# EAGLE schematic BBQ (EAGLE 6.5.0)
CHECK_DATE: 05.03.14; DRAW_DATE: 11.03.14; PROJECT: TMC_breakout_board_panel_1; REV: 01B

## Sheet 1 of 3
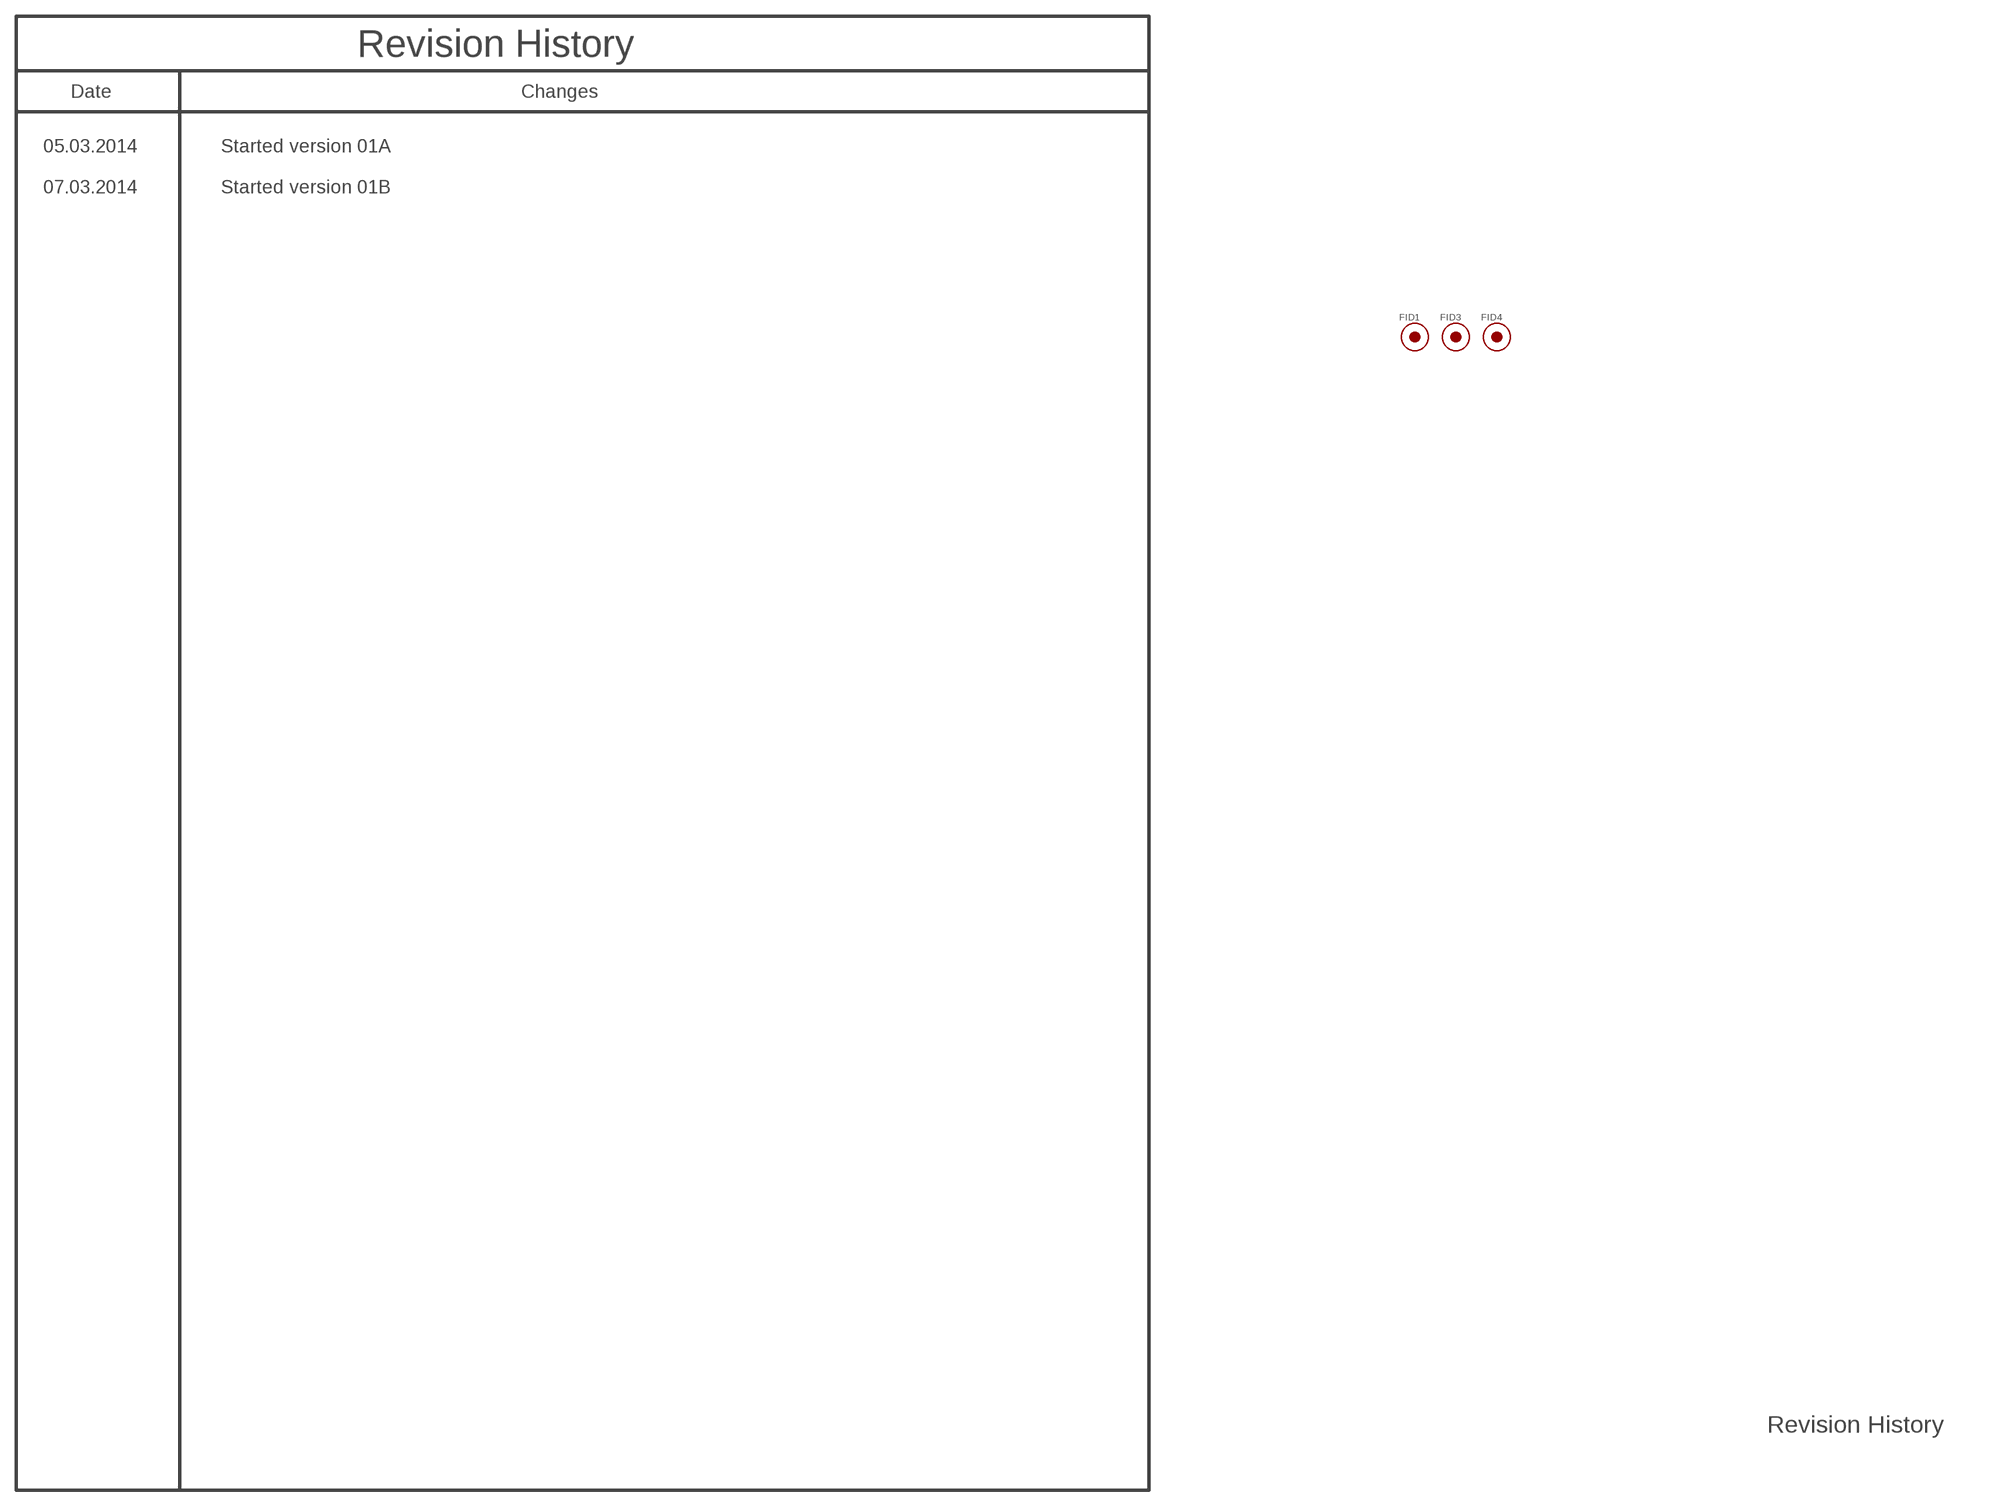
[diagram p0: schematic, sheet 1]

### Parts
FID1  FIDUCIAL  [FIDUCIAL]
FID3  FIDUCIAL  [FIDUCIAL]
FID4  FIDUCIAL  [FIDUCIAL]

### Notes on the sheet
- Revision History
- Date | Changes
- 05.03.2014 | Started version 01A
- 07.03.2014 | Started version 01B
- Revision History

## Sheet 2 of 3
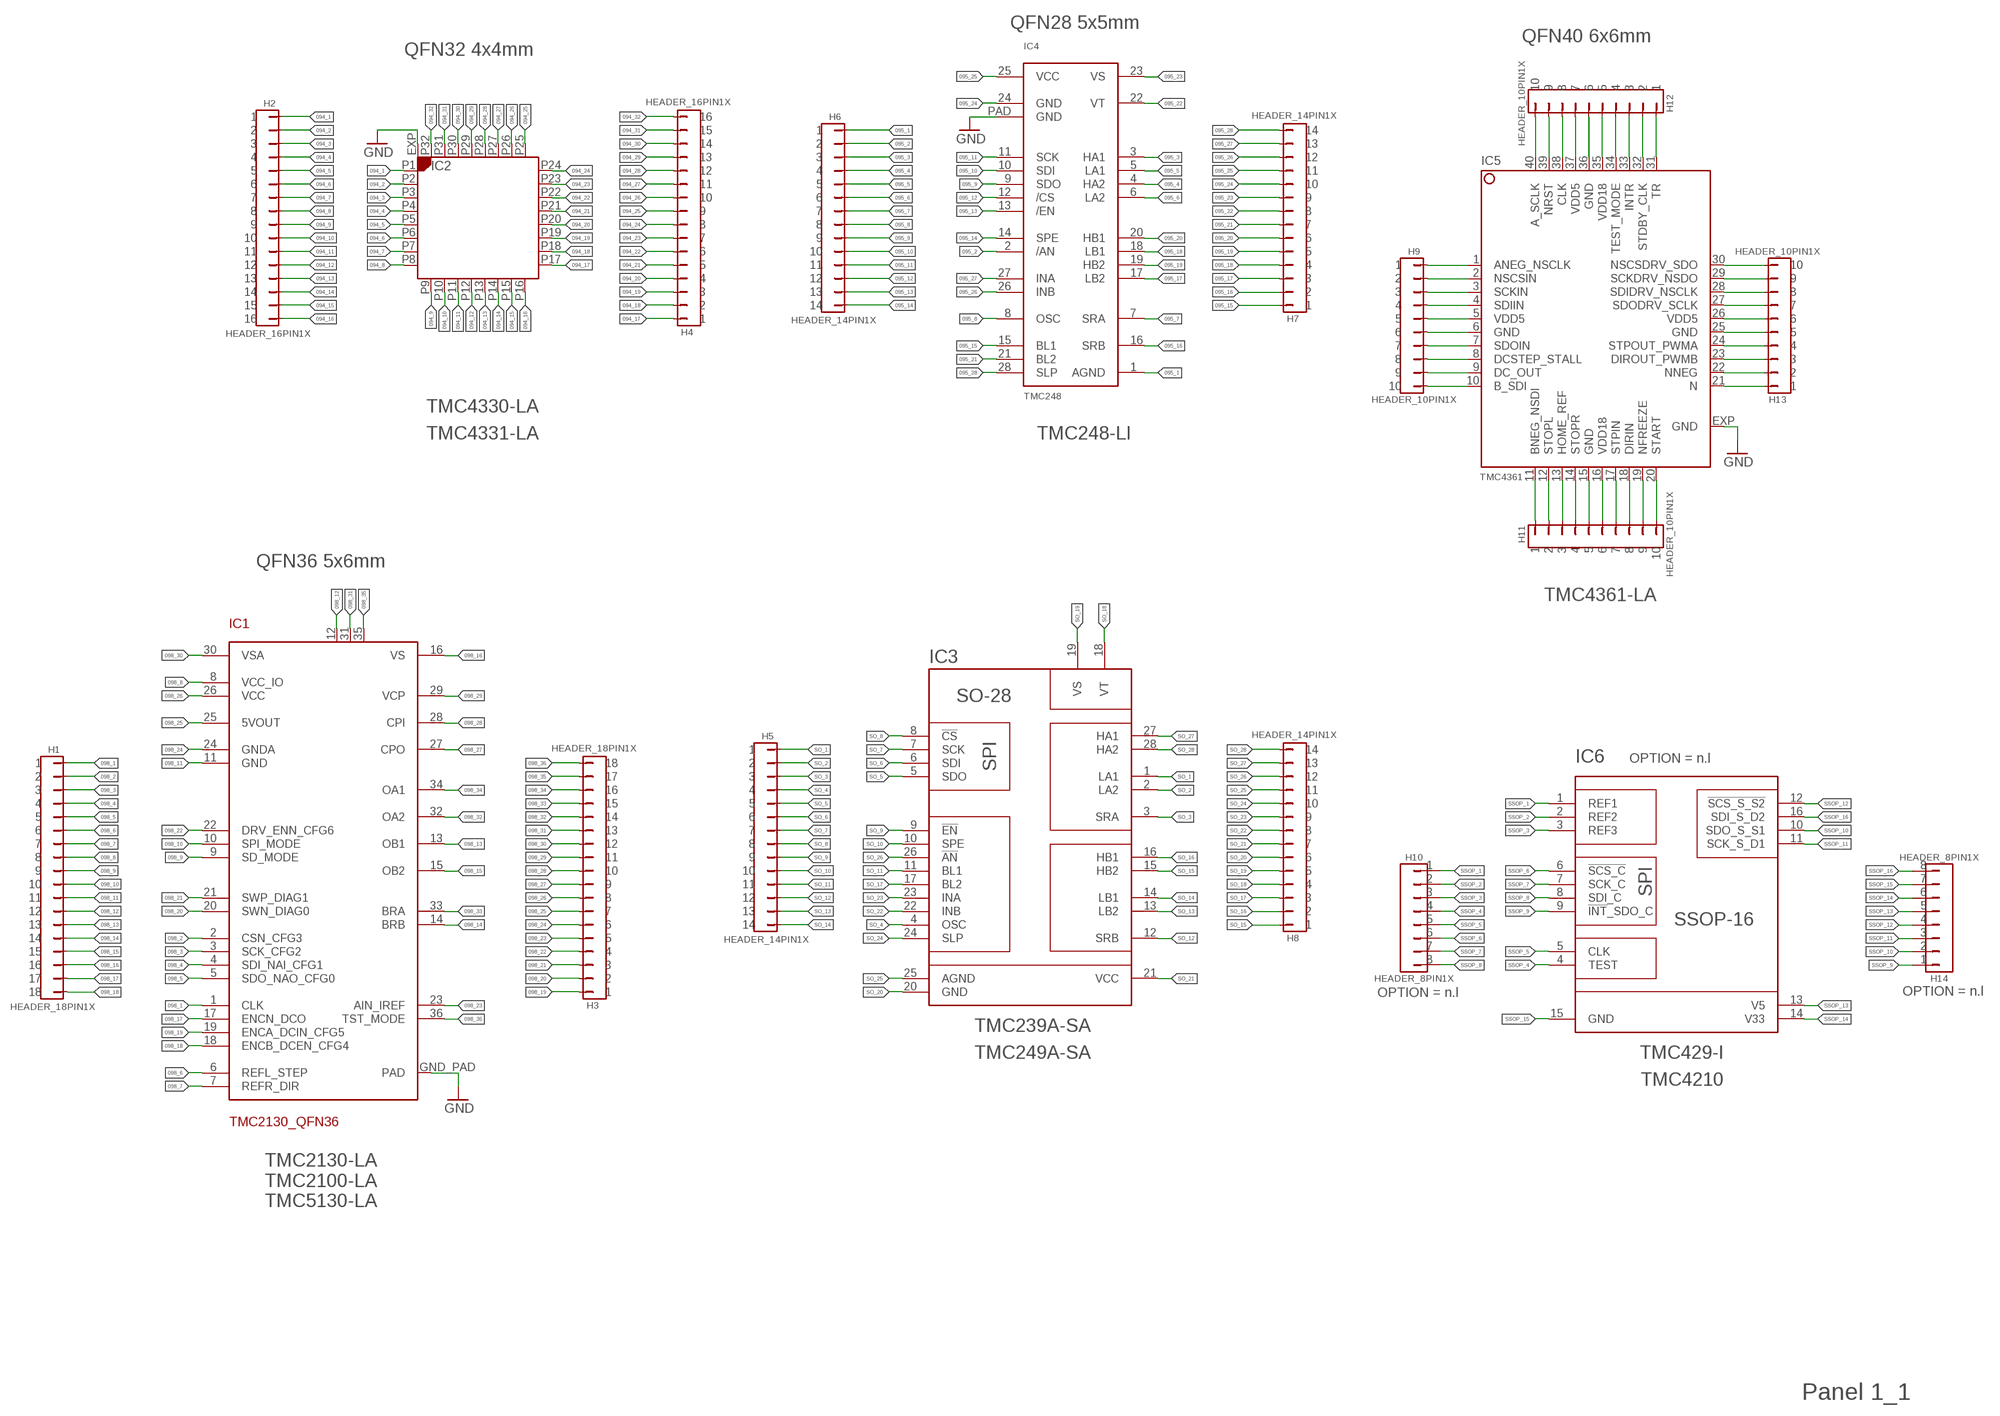
[diagram p1: schematic, sheet 2]

### Parts
H1  HEADER_18PIN1X  [18PIN_2.54_TH]
H2  HEADER_16PIN1X  [16PIN_2.54_TH]
H3  HEADER_18PIN1X  [18PIN_2.54_TH]
H4  HEADER_16PIN1X  [16PIN_2.54_TH]
H5  HEADER_14PIN1X  [14PIN_2.54_TH]
H6  HEADER_14PIN1X  [14PIN_2.54_TH]
H7  HEADER_14PIN1X  [14PIN_2.54_TH]
H8  HEADER_14PIN1X  [14PIN_2.54_TH]
H9  HEADER_10PIN1X  [10PIN_2.54_TH]
H10  HEADER_8PIN1X  [8PIN_2.54_TH]
H11  HEADER_10PIN1X  [10PIN_2.54_TH]
H12  HEADER_10PIN1X  [10PIN_2.54_TH]
H13  HEADER_10PIN1X  [10PIN_2.54_TH]
H14  HEADER_8PIN1X  [8PIN_2.54_TH]
IC1  TMC2130_QFN36  [QFN36]
IC2  TMC4330-LA  [QFN-32_4X4]
IC3  TMC249A-SA  [SO28]
IC4  TMC248  [QFN28_5X5]
IC5  TMC4361  [QFN40L]
IC6  TMC429-I  [SSOP16]

### Nets
094_1: H2.1 IC2.P1
094_2: H2.2 IC2.P2
094_3: H2.3 IC2.P3
094_4: H2.4 IC2.P4
094_5: H2.5 IC2.P5
094_6: H2.6 IC2.P6
094_7: H2.7 IC2.P7
094_8: H2.8 IC2.P8
094_9: H2.9 IC2.P9
094_10: H2.10 IC2.P10
094_11: H2.11 IC2.P11
094_12: H2.12 IC2.P12
094_13: H2.13 IC2.P13
094_14: H2.14 IC2.P14
094_15: H2.15 IC2.P15
094_16: H2.16 IC2.P16
094_17: H4.1 IC2.P17
094_18: H4.2 IC2.P18
094_19: H4.3 IC2.P19
094_20: H4.4 IC2.P20
094_21: H4.5 IC2.P21
094_22: H4.6 IC2.P22
094_23: H4.7 IC2.P23
094_24: H4.8 IC2.P24
094_25: H4.9 IC2.P25
094_26: H4.10 IC2.P26
094_27: H4.11 IC2.P27
094_28: H4.12 IC2.P28
094_29: H4.13 IC2.P29
094_30: H4.14 IC2.P30
094_31: H4.15 IC2.P31
094_32: H4.16 IC2.P32
094_GND: IC2.EXP ; supply symbol labelled GND
095_1: H6.1 IC4.1(AGND)
095_2: H6.2 IC4.2(/AN)
095_3 [wider]: H6.3 IC4.3(HA1)
095_4 [wider]: H6.4 IC4.4(HA2)
095_5 [wider]: H6.5 IC4.5(LA1)
095_6 [wider]: H6.6 IC4.6(LA2)
095_7 [wider]: H6.7 IC4.7(SRA)
095_8: H6.8 IC4.8(OSC)
095_9: H6.9 IC4.9(SDO)
095_10: H6.10 IC4.10(SDI)
095_11: H6.11 IC4.11(SCK)
095_12: H6.12 IC4.12(/CS)
095_13: H6.13 IC4.13(/EN)
095_14: H6.14 IC4.14(SPE)
095_15: H7.1 IC4.15(BL1)
095_16 [wider]: H7.2 IC4.16(SRB)
095_17 [wider]: H7.3 IC4.17(LB2)
095_18 [wider]: H7.4 IC4.18(LB1)
095_19 [wider]: H7.5 IC4.19(HB2)
095_20 [wider]: H7.6 IC4.20(HB1)
095_21 [wider]: H7.7 IC4.21(BL2)
095_22: H7.8 IC4.22(VT)
095_23 [wider]: H7.9 IC4.23(VS)
095_24: H7.10 IC4.24(GND)
095_25: H7.11 IC4.25(VCC)
095_26: H7.12 IC4.26(INB)
095_27: H7.13 IC4.27(INA)
095_28: H7.14 IC4.28(SLP)
095_GND: IC4.PAD(GND) ; supply symbol labelled GND
097_GND: IC5.EXP(GND) ; supply symbol labelled GND
098_1: H1.1 IC1.1(CLK)
098_2: H1.2 IC1.2(CSN_CFG3)
098_3: H1.3 IC1.3(SCK_CFG2)
098_4: H1.4 IC1.4(SDI_NAI_CFG1)
098_5: H1.5 IC1.5(SDO_NAO_CFG0)
098_6: H1.6 IC1.6(REFL_STEP)
098_7: H1.7 IC1.7(REFR_DIR)
098_8: H1.8 IC1.8(VCC_IO)
098_9: H1.9 IC1.9(SD_MODE)
098_10: H1.10 IC1.10(SPI_MODE)
098_11: H1.11 IC1.11(GND)
098_12 [wider]: H1.12 IC1.12
098_13 [wider]: H1.13 IC1.13(OB1)
098_14 [wider]: H1.14 IC1.14(BRB)
098_15 [wider]: H1.15 IC1.15(OB2)
098_16 [wider]: H1.16 IC1.16(VS)
098_17: H1.17 IC1.17(ENCN_DCO)
098_18: H1.18 IC1.18(ENCB_DCEN_CFG4)
098_19: H3.1 IC1.19(ENCA_DCIN_CFG5)
098_20: H3.2 IC1.20(SWN_DIAG0)
098_21: H3.3 IC1.21(SWP_DIAG1)
098_22: H3.4 IC1.22(DRV_ENN_CFG6)
098_23: H3.5 IC1.23(AIN_IREF)
098_24 [wider]: H3.6 IC1.24(GNDA)
098_25: H3.7 IC1.25(5VOUT)
098_26: H3.8 IC1.26(VCC)
098_27: H3.9 IC1.27(CPO)
098_28: H3.10 IC1.28(CPI)
098_29 [wider]: H3.11 IC1.29(VCP)
098_30 [wider]: H3.12 IC1.30(VSA)
098_31 [wider]: H3.13 IC1.31
098_32 [wider]: H3.14 IC1.32(OA2)
098_33 [wider]: H3.15 IC1.33(BRA)
098_34 [wider]: H3.16 IC1.34(OA1)
098_35 [wider]: H3.17 IC1.35
098_36: H3.18 IC1.36(TST_MODE)
098_GND: IC1.GND_PAD(PAD) ; supply symbol labelled GND
N$61: H9.1 IC5.1(ANEG_NSCLK)
N$62: H9.2 IC5.2(NSCSIN)
N$63: H9.3 IC5.3(SCKIN)
N$64: H9.4 IC5.4(SDIIN)
N$65: H9.5 IC5.5(VDD5)
N$66: H9.6 IC5.6(GND)
N$67: H9.7 IC5.7(SDOIN)
N$68: H9.8 IC5.8(DCSTEP_STALL)
N$69: H9.9 IC5.9(DC_OUT)
N$70: H9.10 IC5.10(B_SDI)
N$71: H11.1 IC5.11(BNEG_NSDI)
N$72: H11.2 IC5.12(STOPL)
N$73: H11.3 IC5.13(HOME_REF)
N$74: H11.4 IC5.14(STOPR)
N$75: H11.5 IC5.15(GND)
N$76: H11.6 IC5.16(VDD18)
N$77: H11.7 IC5.17(STPIN)
N$78: H11.8 IC5.18(DIRIN)
N$79: H11.9 IC5.19(NFREEZE)
N$80: H11.10 IC5.20(START)
N$81: H13.1 IC5.21(N)
N$82: H13.2 IC5.22(NNEG)
N$83: H13.3 IC5.23(DIROUT_PWMB)
N$84: H13.4 IC5.24(STPOUT_PWMA)
N$85: H13.5 IC5.25(GND)
N$86: H13.6 IC5.26(VDD5)
N$87: H13.7 IC5.27(SDODRV_SCLK)
N$88: H13.8 IC5.28(SDIDRV_NSCLK)
N$89: H13.9 IC5.29(SCKDRV_NSDO)
N$90: H13.10 IC5.30(NSCSDRV_SDO)
N$91: H12.1 IC5.31(TR)
N$92: H12.2 IC5.32(STDBY_CLK)
N$93: H12.3 IC5.33(INTR)
N$94: H12.4 IC5.34(TEST_MODE)
N$95: H12.5 IC5.35(VDD18)
N$96: H12.6 IC5.36(GND)
N$98: H12.7 IC5.37(VDD5)
N$99: H12.8 IC5.38(CLK)
N$100: H12.9 IC5.39(NRST)
N$101: H12.10 IC5.40(A_SCLK)
SO_1 [wider]: H5.1 IC3.1(LA1)
SO_2 [wider]: H5.2 IC3.2(LA2)
SO_3 [wider]: H5.3 IC3.3(SRA)
SO_4: H5.4 IC3.4(OSC)
SO_5: H5.5 IC3.5(SDO)
SO_6: H5.6 IC3.6(SDI)
SO_7: H5.7 IC3.7(SCK)
SO_8: H5.8 IC3.8(!CS)
SO_9: H5.9 IC3.9(!EN)
SO_10: H5.10 IC3.10(SPE)
SO_11: H5.11 IC3.11(BL1)
SO_12 [wider]: H5.12 IC3.12(SRB)
SO_13 [wider]: H5.13 IC3.13(LB2)
SO_14 [wider]: H5.14 IC3.14(LB1)
SO_15 [wider]: H8.1 IC3.15(HB2)
SO_16 [wider]: H8.2 IC3.16(HB1)
SO_17: H8.3 IC3.17(BL2)
SO_18: H8.4 IC3.18(VT)
SO_19 [wider]: H8.5 IC3.19(VS)
SO_20: H8.6 IC3.20(GND)
SO_21: H8.7 IC3.21(VCC)
SO_22: H8.8 IC3.22(INB)
SO_23: H8.9 IC3.23(INA)
SO_24: H8.10 IC3.24(SLP)
SO_25: H8.11 IC3.25(AGND)
SO_26: H8.12 IC3.26(!AN)
SO_27 [wider]: H8.13 IC3.27(HA1)
SO_28 [wider]: H8.14 IC3.28(HA2)
SSOP_1: H10.1 IC6.1(REF1)
SSOP_2: H10.2 IC6.2(REF2)
SSOP_3: H10.3 IC6.3(REF3)
SSOP_4: H10.4 IC6.4(TEST)
SSOP_5: H10.5 IC6.5(CLK)
SSOP_6: H10.6 IC6.6(!SCS_C)
SSOP_7: H10.7 IC6.7(SCK_C)
SSOP_8: H10.8 IC6.8(SDI_C)
SSOP_9: H14.1 IC6.9(!INT!_SDO_C)
SSOP_10: H14.2 IC6.10(SDO_S_S1)
SSOP_11: H14.3 IC6.11(SCK_S_D1)
SSOP_12: H14.4 IC6.12(!SCS_S_S2)
SSOP_13: H14.5 IC6.13(V5)
SSOP_14: H14.6 IC6.14(V33)
SSOP_15: H14.7 IC6.15(GND)
SSOP_16: H14.8 IC6.16(SDI_S_D2)

### Notes on the sheet
- QFN28 5x5mm
- QFN40 6x6mm
- QFN32 4x4mm
- TMC4330-LA
- TMC4331-LA | TMC248-LI
- QFN36 5x6mm
- TMC4361-LA
- SO-28
- SSOP-16
- TMC239A-SA
- TMC4210
- TMC2130-LA
  TMC2100-LA
  TMC5130-LA
- Panel 1_1

## Sheet 3 of 3
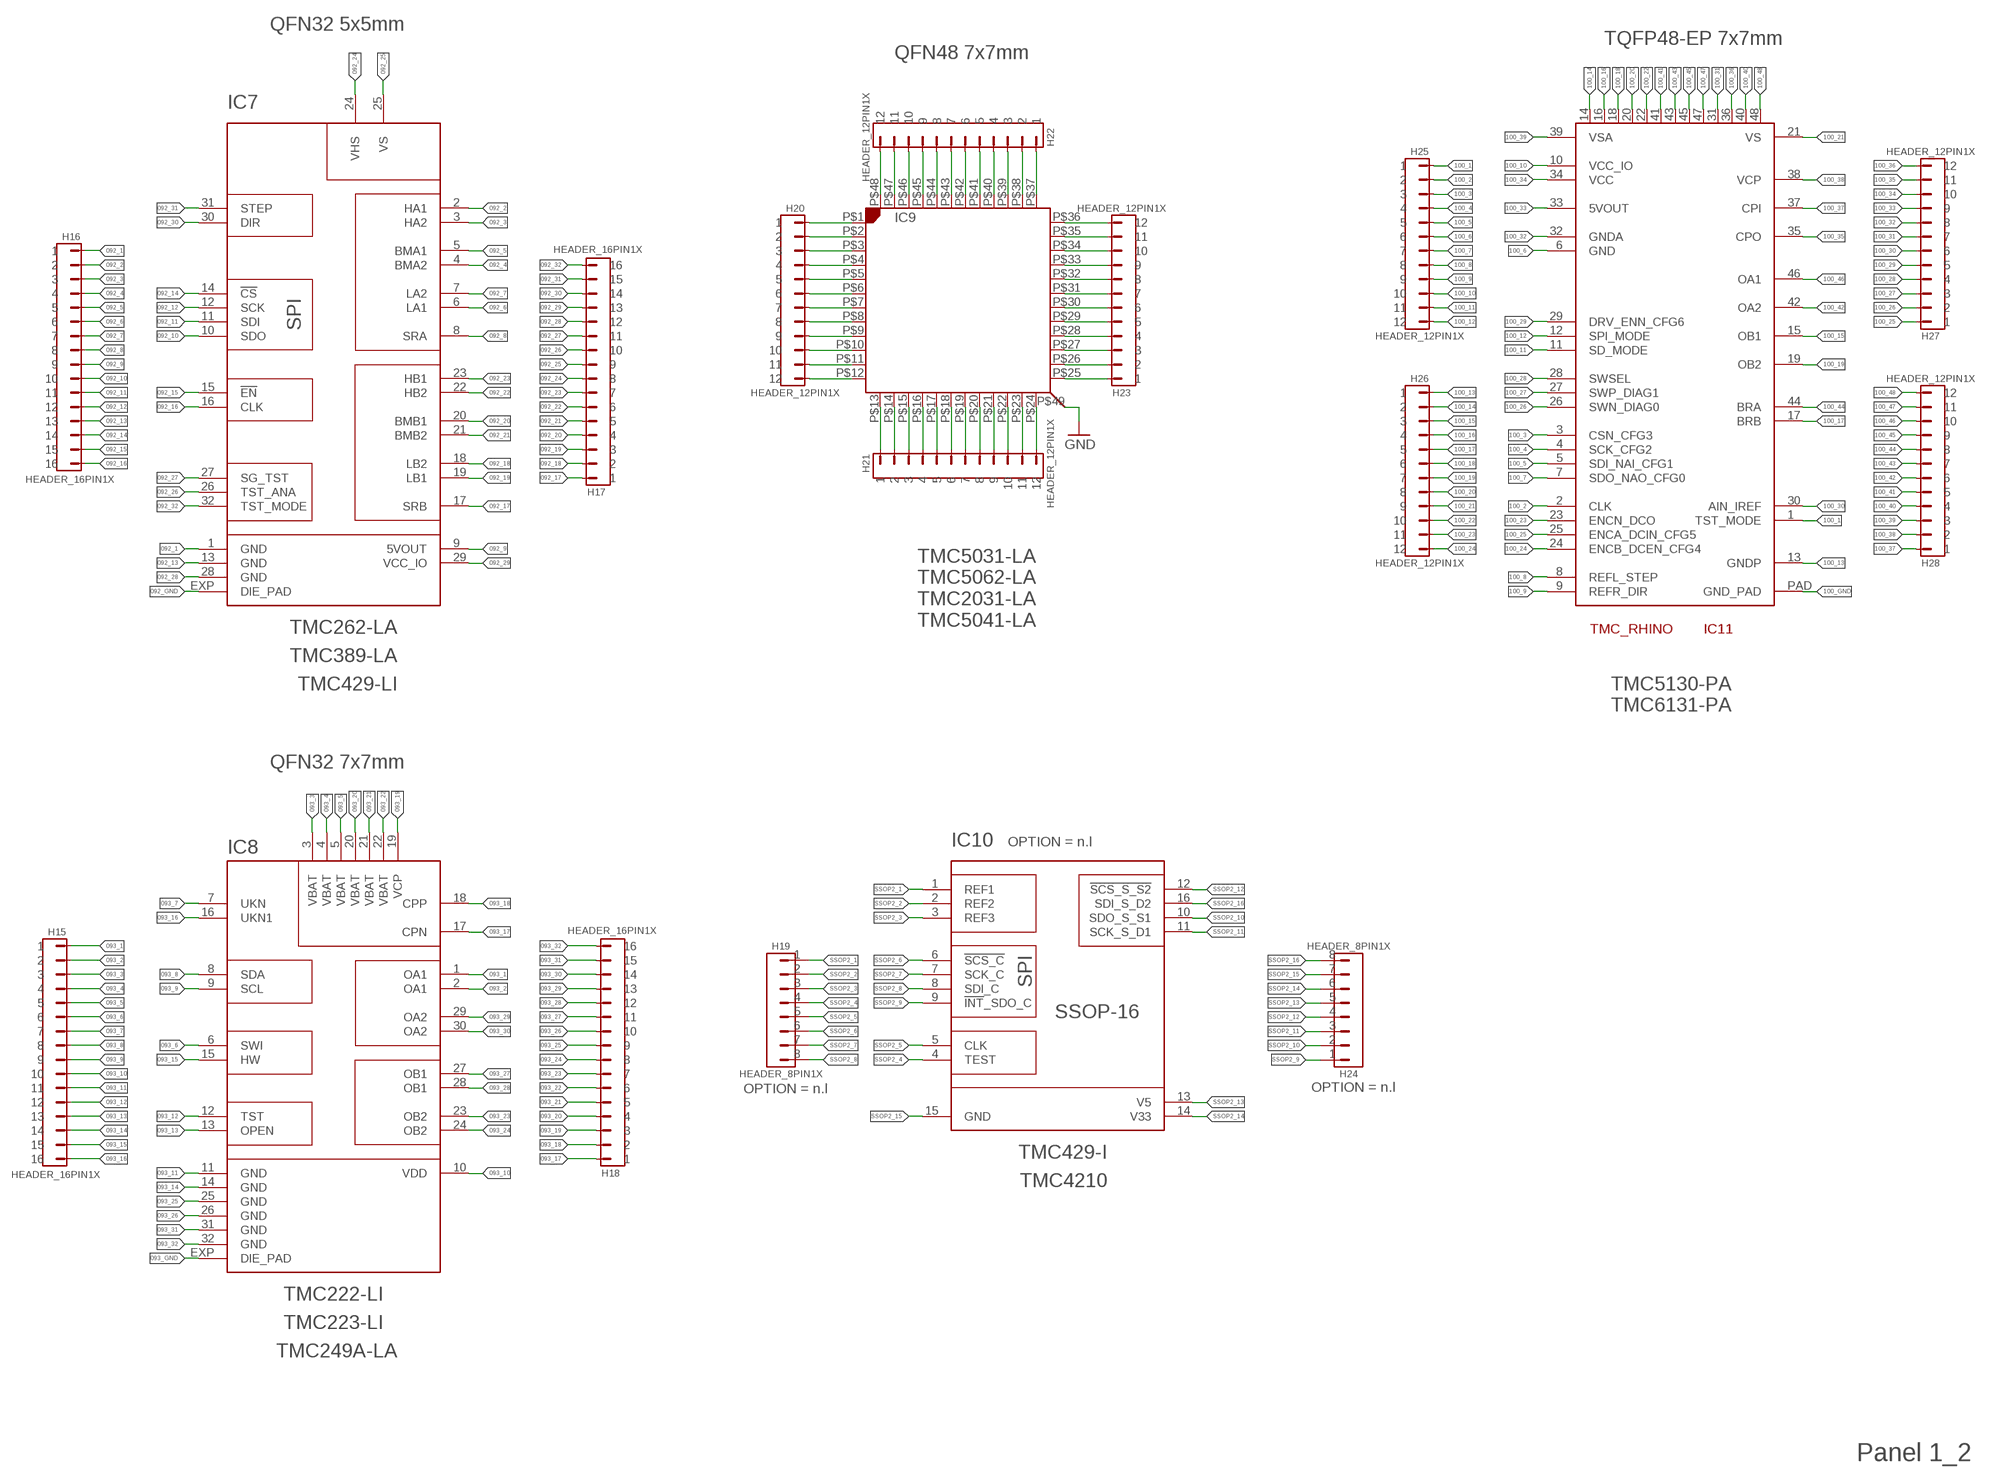
[diagram p2: schematic, sheet 3]

### Parts
H15  HEADER_16PIN1X  [16PIN_2.54_TH]
H16  HEADER_16PIN1X  [16PIN_2.54_TH]
H17  HEADER_16PIN1X  [16PIN_2.54_TH]
H18  HEADER_16PIN1X  [16PIN_2.54_TH]
H19  HEADER_8PIN1X  [8PIN_2.54_TH]
H20  HEADER_12PIN1X  [12PIN_2.54_TH]
H21  HEADER_12PIN1X  [12PIN_2.54_TH]
H22  HEADER_12PIN1X  [12PIN_2.54_TH]
H23  HEADER_12PIN1X  [12PIN_2.54_TH]
H24  HEADER_8PIN1X  [8PIN_2.54_TH]
H25  HEADER_12PIN1X  [12PIN_2.54_TH]
H26  HEADER_12PIN1X  [12PIN_2.54_TH]
H27  HEADER_12PIN1X  [12PIN_2.54_TH]
H28  HEADER_12PIN1X  [12PIN_2.54_TH]
IC7  TMC262-LA  [QFN32_5X5]
IC8  TMC222-LI  [QFN32_7X7]
IC9  TMC5031-LA  [QFN-48_7X7]
IC10  TMC429-I  [SSOP16]
IC11  TMC_RHINO  [TQFP48-EP]

### Nets
092_1: H16.1 IC7.1(GND)
092_2 [wider]: H16.2 IC7.2(HA1)
092_3 [wider]: H16.3 IC7.3(HA2)
092_4 [wider]: H16.4 IC7.4(BMA2)
092_5 [wider]: H16.5 IC7.5(BMA1)
092_6 [wider]: H16.6 IC7.6(LA1)
092_7 [wider]: H16.7 IC7.7(LA2)
092_8 [wider]: H16.8 IC7.8(SRA)
092_9: H16.9 IC7.9(5VOUT)
092_10: H16.10 IC7.10(SDO)
092_11: H16.11 IC7.11(SDI)
092_12: H16.12 IC7.12(SCK)
092_13: H16.13 IC7.13(GND)
092_14: H16.14 IC7.14(!CS)
092_15: H16.15 IC7.15(!EN)
092_16: H16.16 IC7.16(CLK)
092_17 [wider]: H17.1 IC7.17(SRB)
092_18 [wider]: H17.2 IC7.18(LB2)
092_19 [wider]: H17.3 IC7.19(LB1)
092_20 [wider]: H17.4 IC7.20(BMB1)
092_21 [wider]: H17.5 IC7.21(BMB2)
092_22 [wider]: H17.6 IC7.22(HB2)
092_23 [wider]: H17.7 IC7.23(HB1)
092_24 [wider]: H17.8 IC7.24(VHS)
092_25 [wider]: H17.9 IC7.25(VS)
092_26: H17.10 IC7.26(TST_ANA)
092_27: H17.11 IC7.27(SG_TST)
092_28: H17.12 IC7.28(GND)
092_29: H17.13 IC7.29(VCC_IO)
092_30: H17.14 IC7.30(DIR)
092_31: H17.15 IC7.31(STEP)
092_32: H17.16 IC7.32(TST_MODE)
092_GND: IC7.EXP(DIE_PAD)
093_1 [wider]: H15.1 IC8.1(OA1)
093_2 [wider]: H15.2 IC8.2(OA1)
093_3 [wider]: H15.3 IC8.3(VBAT)
093_4 [wider]: H15.4 IC8.4(VBAT)
093_5: H15.5 IC8.5(VBAT)
093_6 [wider]: H15.6 IC8.6(SWI)
093_7 [wider]: H15.7 IC8.7(UKN)
093_8 [wider]: H15.8 IC8.8(SDA)
093_9: H15.9 IC8.9(SCL)
093_10: H15.10 IC8.10(VDD)
093_11: H15.11 IC8.11(GND)
093_12: H15.12 IC8.12(TST)
093_13: H15.13 IC8.13(OPEN)
093_14: H15.14 IC8.14(GND)
093_15: H15.15 IC8.15(HW)
093_16: H15.16 IC8.16(UKN1)
093_17 [wider]: H18.1 IC8.17(CPN)
093_18 [wider]: H18.2 IC8.18(CPP)
093_19: H18.3 IC8.19(VCP)
093_20: H18.4 IC8.20(VBAT)
093_21 [wider]: H18.5 IC8.21(VBAT)
093_22 [wider]: H18.6 IC8.22(VBAT)
093_23 [wider]: H18.7 IC8.23(OB2)
093_24 [wider]: H18.8 IC8.24(OB2)
093_25 [wider]: H18.9 IC8.25(GND)
093_26: H18.10 IC8.26(GND)
093_27 [wider]: H18.11 IC8.27(OB1)
093_28 [wider]: H18.12 IC8.28(OB1)
093_29 [wider]: H18.13 IC8.29(OA2)
093_30 [wider]: H18.14 IC8.30(OA2)
093_31: H18.15 IC8.31(GND)
093_32: H18.16 IC8.32(GND)
093_GND: IC8.EXP(DIE_PAD)
096_GND: IC9.P$49(EXP) ; supply symbol labelled GND
100_1: H25.1 IC11.1(TST_MODE)
100_2: H25.2 IC11.2(CLK)
100_3: H25.3 IC11.3(CSN_CFG3)
100_4: H25.4 IC11.4(SCK_CFG2)
100_5: H25.5 IC11.5(SDI_NAI_CFG1)
100_6: H25.6 IC11.6(GND)
100_7: H25.7 IC11.7(SDO_NAO_CFG0)
100_8: H25.8 IC11.8(REFL_STEP)
100_9: H25.9 IC11.9(REFR_DIR)
100_10: H25.10 IC11.10(VCC_IO)
100_11: H25.11 IC11.11(SD_MODE)
100_12: H25.12 IC11.12(SPI_MODE)
100_13 [wider]: H26.1 IC11.13(GNDP)
100_14: H26.2 IC11.14
100_15 [wider]: H26.3 IC11.15(OB1)
100_16: H26.4 IC11.16
100_17 [wider]: H26.5 IC11.17(BRB)
100_18: H26.6 IC11.18
100_19 [wider]: H26.7 IC11.19(OB2)
100_20: H26.8 IC11.20
100_21 [wider]: H26.9 IC11.21(VS)
100_22: H26.10 IC11.22
100_23: H26.11 IC11.23(ENCN_DCO)
100_24: H26.12 IC11.24(ENCB_DCEN_CFG4)
100_25: H27.1 IC11.25(ENCA_DCIN_CFG5)
100_26: H27.2 IC11.26(SWN_DIAG0)
100_27: H27.3 IC11.27(SWP_DIAG1)
100_28: H27.4 IC11.28(SWSEL)
100_29: H27.5 IC11.29(DRV_ENN_CFG6)
100_30: H27.6 IC11.30(AIN_IREF)
100_31: H27.7 IC11.31
100_32 [wider]: H27.8 IC11.32(GNDA)
100_33: H27.9 IC11.33(5VOUT)
100_34: H27.10 IC11.34(VCC)
100_35: H27.11 IC11.35(CPO)
100_36: H27.12 IC11.36
100_37: H28.1 IC11.37(CPI)
100_38 [wider]: H28.2 IC11.38(VCP)
100_39 [wider]: H28.3 IC11.39(VSA)
100_40 [wider]: H28.4 IC11.40
100_41: H28.5 IC11.41
100_42 [wider]: H28.6 IC11.42(OA2)
100_43: H28.7 IC11.43
100_44 [wider]: H28.8 IC11.44(BRA)
100_45: H28.9 IC11.45
100_46 [wider]: H28.10 IC11.46(OA1)
100_47: H28.11 IC11.47
100_48 [wider]: H28.12 IC11.48
100_GND: IC11.PAD(GND_PAD)
N$13: H20.1 IC9.P$1
N$14: H20.2 IC9.P$2
N$15: H20.3 IC9.P$3
N$16: H20.4 IC9.P$4
N$17: H20.5 IC9.P$5
N$18: H20.6 IC9.P$6
N$19: H20.7 IC9.P$7
N$20: H20.8 IC9.P$8
N$21: H20.9 IC9.P$9
N$22: H20.10 IC9.P$10
N$23: H20.11 IC9.P$11
N$24: H20.12 IC9.P$12
N$25: H21.1 IC9.P$13
N$26 [wider]: H21.2 IC9.P$14
N$27 [wider]: H21.3 IC9.P$15
N$28 [wider]: H21.4 IC9.P$16
N$29 [wider]: H21.5 IC9.P$17
N$30: H21.6 IC9.P$18
N$31 [wider]: H21.7 IC9.P$19
N$32 [wider]: H21.8 IC9.P$20
N$33 [wider]: H21.9 IC9.P$21
N$34 [wider]: H21.10 IC9.P$22
N$35: H21.11 IC9.P$23
N$36: H21.12 IC9.P$24
N$37: H23.1 IC9.P$25
N$38: H23.2 IC9.P$26
N$39: H23.3 IC9.P$27
N$40: H23.4 IC9.P$28
N$41: H23.5 IC9.P$29
N$42 [wider]: H23.6 IC9.P$30
N$43 [wider]: H23.7 IC9.P$31
N$44: H23.8 IC9.P$32
N$45: H23.9 IC9.P$33
N$46 [wider]: H23.10 IC9.P$34
N$47: H23.11 IC9.P$35
N$48: H23.12 IC9.P$36
N$49 [wider]: H22.1 IC9.P$37
N$50: H22.2 IC9.P$38
N$51 [wider]: H22.3 IC9.P$39
N$52 [wider]: H22.4 IC9.P$40
N$53 [wider]: H22.5 IC9.P$41
N$54: H22.6 IC9.P$42
N$55: H22.7 IC9.P$43
N$56: H22.8 IC9.P$44
N$57 [wider]: H22.9 IC9.P$45
N$58 [wider]: H22.10 IC9.P$46
N$59 [wider]: H22.11 IC9.P$47
N$60: H22.12 IC9.P$48
SSOP2_1: H19.1 IC10.1(REF1)
SSOP2_2: H19.2 IC10.2(REF2)
SSOP2_3: H19.3 IC10.3(REF3)
SSOP2_4: H19.4 IC10.4(TEST)
SSOP2_5: H19.5 IC10.5(CLK)
SSOP2_6: H19.6 IC10.6(!SCS_C)
SSOP2_7: H19.7 IC10.7(SCK_C)
SSOP2_8: H19.8 IC10.8(SDI_C)
SSOP2_9: H24.1 IC10.9(!INT!_SDO_C)
SSOP2_10: H24.2 IC10.10(SDO_S_S1)
SSOP2_11: H24.3 IC10.11(SCK_S_D1)
SSOP2_12: H24.4 IC10.12(!SCS_S_S2)
SSOP2_13: H24.5 IC10.13(V5)
SSOP2_14: H24.6 IC10.14(V33)
SSOP2_15: H24.7 IC10.15(GND)
SSOP2_16: H24.8 IC10.16(SDI_S_D2)

### Notes on the sheet
- QFN32 5x5mm
- TQFP48-EP 7x7mm
- QFN48 7x7mm
- TMC5031-LA
  TMC5062-LA
  TMC2031-LA
  TMC5041-LA
- TMC389-LA
- TMC429-LI
- TMC5130-PA
  TMC6131-PA
- QFN32 7x7mm
- SSOP-16
- TMC4210
- TMC223-LI
- TMC249A-LA
- Panel 1_2

## Library data of the parts
FID1 FID3 FID4 = Trinamic:FIDUCIAL: Fiducial component
H1 H3 = Trinamic:HEADER_18PIN1X: 18 Pin Header, 1 row, 2.54mm through hole; ADGPN: 3004011800; DATASHEET: http://portal.fciconnect.com/Comergent//fci/drawing/68000.pdf; MANUFACTURER: FCI; MANUFACTURER-CODE: 68000-118HLF; SUPPLIER: DigiKey; SUPPLIER-CODE: 68000-118HLF-ND
H2 H4 H15-H18 = Trinamic:HEADER_16PIN1X: 16 Pin Header, 1 row, 2.54mm through hole; ADGPN: 3004011610; DATASHEET: http://portal.fciconnect.com/Comergent//fci/drawing/68000.pdf; MANUFACTURER: FCI; MANUFACTURER-CODE: 68000-116HLF; PRICE: 0,66; SUPPLIER: DigiKey; SUPPLIER-CODE: 609-3252-ND
H5-H8 = Trinamic:HEADER_14PIN1X: 14 Pin Header, 1 row, 2.54mm through hole; ADGPN: 3004011400; DATASHEET: http://portal.fciconnect.com/Comergent//fci/drawing/68000.pdf; MANUFACTURER: FCI; MANUFACTURER-CODE: 68000-114HLF; SUPPLIER: DigiKey; SUPPLIER-CODE: 68000-114HLF-ND
H9 H11-H13 = Trinamic:HEADER_10PIN1X: 10 Pin Header, 1 row, 2.54mm through hole; ADGPN: 3004011010; DATASHEET: http://portal.fciconnect.com/Comergent//fci/drawing/68000.pdf; MANUFACTURER: FCI; MANUFACTURER-CODE: 68000-110HLF; SUPPLIER: DigiKey; SUPPLIER-CODE: 609-3250-ND
H10 H14 H19 H24 = Trinamic:HEADER_8PIN1X: 8 Pin Header, 1 row, 2.54mm through hole Datasheet <http://www.molex.com/pdm_docs/sd/022284031_sd.pdf>; ADGPN: 3004010800; MANUFACTURER: Molex; MANUFACTURER-CODE: 22-28-4083; OPTION: n.l; PRICE: 0.43; SUPPLIER: DigiKey; SUPPLIER-CODE: WM50016-08-ND
H20-H23 H25-H28 = Trinamic:HEADER_12PIN1X: 12 Pin Header, 1 row, 2.54mm through hole; ADGPN: 3004011210; DATASHEET: http://portal.fciconnect.com/Comergent//fci/drawing/68000.pdf; GEOMETRY_HEIGHT: 5.84mm; MANUFACTURER: FCI; MANUFACTURER-CODE: 68000-112HLF; PRICE: 0,37; SUPPLIER: DigiKey; SUPPLIER-CODE: 609-3251-ND
IC1 = TMC2130_QFN:TMC2130_QFN36
IC2 = Trinamic:TMC4330-LA: Also TMC4331-LA. Resembles QFN-32 4x4mm package. Done for breakout board. Pinning unknown
IC3 = trinamic_intern:TMC249A-SA: TRINAMIC Smart Power Microstepping PWM Motor Driver with stallGuard™ Information given in this library is believed to be accurate and reliable. However no warranty is given for its correctness. Datasheet for TMC249 <http://www.trinamic.com/tmc/media/Downloads/integrated_circuits/Tmc249/TMC249_datasheet.pdf> Description Smart Power Microstepping PWM Motor Driver with stallGuard™ sensorless stall detection, external power transistors and protection, diagnostics and SPI Interface The TMC249 is a smart high current microstepping driver for bipolar stepper motors. The integrated unique sensorless stall detection stallGuard™ makes it a good choice for applications, where a reference point is needed, but where a switch cannot be used. The ability to predict an overload makes the TMC249 an optimum choice for drives, where a high reliability is desired. It provides an SPI™ interface as well as the classical analog / digital control. A full set of protection and diagnostic features makes this device very rugged. It directly drives external MOSFETs for currents up to 6A. This way it reaches an extremely high efficiency and allows driving of a high motor current without cooling measures even at high environment temperatures. With the new chip-scale QFN package a 4A motor driver can be realized on the size of a stamp! The high motor current makes this device ideal for miniaturized highly dynamic and high torque drive systems. Specifications 2-phase bipolar stepper motor driver Sensorless stall detection stallGuard™ and load measurement integrated Control via SPI with easy-to-use 12 bit protocol or external analog / digital signals Short circuit and over temperature protection integrated Overvoltage protection integrated Status flags for overcurrent, open load, over temperature, temperature pre-warning, undervoltage Integrated 4 bit DACs allow up to 16 times microstepping via SPI, any resolution via analog control Mixed decay feature for smooth motor operation Slope control user programmable to reduce electromagnetic emissions Chopper frequency programmable via a single capacitor or external clock Current control allows cool motor and driver operation Internal open load detector 7V to 34V motor supply voltage More than 6000mA using 8 external MOS transistors External drivers can be added for higher motor voltages and higher currents (e.g. 50V, 5A) Only 4 external PMOS transistors required for unipolar operation 3.3V or 5V operation for digital part Low power consumption via low RDS-ON power stage Standby and shutdown mode available
IC4 = TMC248:TMC248: TRINAMIC Low-cost stepper driver for two-phase bipolar motors with low noise PWM chopper and stallGuard?. Information given in this library is believed to be accurate and reliable. However no warranty is given for its correctness. Datasheet for TMC248 <http://www.trinamic.com> FEATURES AND BENEFITS High Current up to 6 A motor current using 4 external dual- MOS transistors. Voltage Range 7 V? 36 V DC, 3.3 V or 5 V DC for digital part SPI & External Analogue / Digital Signals Microstep Resolution up to 64 microsteps per full step Low Power Dissipation via low RDS-ON power stage Protection: overvoltage, overtemperature & short circuit Diagnostics: overcurrent, open load, overtemperature, temperature prewarning, and undervoltage stallGuard? sensorless stall detection and load measurement Mixed Decay for smooth motor operation Slope Control for reduced electromagnetic emissions Current Control for cool motor and driver Standby and Shutdown Mode Smallest Size 5x5mm QFN28 package
IC5 = Trinamic:TMC4361: Single-Axis s-ramp motion controller; ADGPN: 4105361700; MANUFACTURER: Trinamic
IC6 IC10 = trinamic_intern:TMC429-I: TRINAMIC 3-axis universal motion controller for stepper motor drivers Information given in this library is believed to be accurate and reliable. However no warranty is given for its correctness. Datasheet for TMC429 <http://www.trinamic.com/tmc/media/Downloads/integrated_circuits/TMC429/TMC429_datasheet.pdf> Description 3-axis universal motion controller for stepper motor drivers The TMC429 is a miniaturized low cost, high performance stepper motor controller for up to three motors. It integrates all real time critical tasks in reliable, dedicated hardware: An integrated motion ramp profile generator as well as an adaptable microstep sequencer with microstep RAM table. Advanced stop- and reference switch handling allows for precise and fast referencing as well as on-the-fly position checking. Automatic motor current control gives high motor dynamics while saving energy. The interrupt output can generate precise position pulses. The TMC429 is fully downwards compatible to the TMC428. The TMC429 connects to the recent coolStep™ drivers (TMC260, TMC262 and TMC389) via Step- & Direction signals (S/D) or to the classic TRINAMIC drivers TMC236, TMC239, TMC246 and TMC249 via SPI™ . The communication with the host microcontroller is done with an extra SPI™ interface. The host just needs to do high-level control tasks, e.g. giving the command: Drive motor 2 to position 1000. The TMC429 automatically calculates the motion ramp based on velocity and acceleration parameters. TMC 429 - the small but intelligent controller Miniaturized low cost 3 axes motor controller High-performance micro stepping SPI™ host interface with easy-to-use protocol Step-/Direction or SPI™ driver interface On-the-fly alteration of position set point Specifications Main characteristics controls up to three stepper motors selectable driver interface: Step&Direction or SPI different types of SPI™ stepper motor driver chips may by mixed within a single daisy chain communication on demand minimizes traffic to the SPI™ stepper motor drivers chain allows read-out of driver status information programmable SPI™ data rates up to 1 Mbit/s wide range for clock frequency - can use CPU clock up to 32 MHz internal 24 bit wide position counters full step frequencies up to 20 kHz individual micro step resolution of {64, 32, 16, 8, 4, 2, 1} micro steps (SPI mode) programmable 6 bit micro step table with up to 64 entries for a quarter sine wave period (SPI mode) on-the-fly alteration of target motion parameters (like position, velocity, acceleration) read-out facility for current motion parameters (position, velocity, acceleration) integrated power-on-reset NEW: "position reached" trigger output Interface Configurable interface for SPI™ motor drivers (e.g. TMC236, TMC239, TMC246, TMC249) Step-/Direction interface for universal motor drivers (e.g. TMC260, TMC262, TMC389) SPI™ host interface Electrical Data 3.3V or 5V operation with CMOS / TTL compatible IOs (all inputs Schmitt-Trigger) Power down mode (100 µA) with transparent wake-up for normal operation (typ. 10 mA @ 16 MHz) Package Chip size 32 pin QFN 5x5mm SOP24 Ultra small 16 pin SSOP (TMC428-I compatible, reduced TMC429 functionality); OPTION: n.l
IC7 = trinamic_intern:TMC262-LA: TRINAMIC Energy efficient microstep driver for external MOSFET's for up to 6A with coolStep™ Information given in this library is believed to be accurate and reliable. However no warranty is given for its correctness. Datasheet for TMC260/261/262 <http://www.trinamic.com/tmc/media/Downloads/integrated_circuits/TMC262/TMC260_TMC261_TMC262_datasheet.pdf> Description Energy efficient microstep driver for external MOSFET's for up to 6A with coolStep™ The TMC262 is the first energy efficient high current high precision microstepping driver IC for bipolar stepper motors. The unique high resolution sensorless load detection stallGuard2™ is used to for the world™s first integrated load dependent current control feature called coolStep™. The ability to read out the load and detect an overload makes the TMC262 an optimum choice for drives where a high reliability is desired at a low cost. The new patented spreadCycle PWM mixed decay chopper scheme ensures best zero crossing performance as well as high speed operation. The TMC262 can be driven with Step & Direction signals as well as by serial SPI™ interface. Using the microPlyer allows to operate the motor with highest 256 ™Step smoothness reducing the input frequency to 16 ™Steps. A full set of protection and diagnostic features makes this device very rugged. It directly drives external MOSFETs for currents of up to 6A. This way it reaches highest energy efficiency and allows driving of a high motor current without cooling measures even at high environment temperatures. Specifications Main characteristics 2-phase bipolar stepper motor driver stallGuard2™ sensorless load detection coolStep™ load dependent current control save up to 80% energy spreadCycle hysteresis PWM chopper best current zero crossing performance best sine wave form 256 ™Steps/fullstep (51200 pos/rev.) with a standard 200 step motor microPlyer 16-to-256 ™Step multiplyer full protection and diagnostics lowest power dissipation programmable slope control for low EME standby and shutdown mode stall / load detection output Low power consumption via low RDS-ON power stage Interface Step & Direction easy-to-use SPI™ (20bit) Electrical Data up to 6A coil current (peak) with just 4 external dual MOSFETS 9V to 60V motor supply full 48V +10% industry voltage support 3.3V or 5V operation for digital part Package QFN32 5x5 mm² chip size package RoHS compliant
IC8 = trinamic_intern:TMC222-LI: TRINAMIC Microstepping stepper motor controller/driver with IIC interface Information given in this library is believed to be accurate and reliable. However no warranty is given for its correctness. Datasheet for TMC222 <http://www.trinamic.com/tmc/media/Downloads/integrated_circuits/Tmc222/TMC222_datasheet.pdf> Description Microstepping stepper motor controller/driver with IIC interface The TMC222 is a combined micro-stepping stepper motor motion controller and driver with RAM and OTP memory. The RAM or OTP memory is used to store motor parameters and configuration settings.The TMC222 allows up to four bit of microstepping and a coil current of up to 800 mA. After initialization it performs all time critical tasks autonomously based on target positions and velocity parameters. Communications to a host takes place via a two wire serial interface. Together with an inexpensive microcontroller the TMC222 forms a complete motion control system. Specifications Motor driver 2-phase bipolar stepper motor controller+driver Controls one stepper motor with four bit microstepping Programmable Coil current up to 800 mA Supply voltage range operating range 8V ... 29V Fixed frequency PWM current control with automatic selection of fast and slow decay mode Full step frequencies up to 1 kHz High temperature, open circuit, short, over-current and under-voltage diagnostics Motion controller Internal 16-bit wide position counter Configurable speed and acceleration settings Build-in ramp generator for autonomous positioning and speed control On-the-fly alteration of target position Reference switch input available for read out Two wire serial interface Transfer rates up to 350 kbps Diagnostics and status information as well as motion parameters accessable Field-programmable node addresses (32)
IC9 = Trinamic:TMC5031-LA: Footprint variant for QFN48 7x7mm. Also fits for TMC5062-LA, TMC2031-LA, TMC5041-LA
IC11 = Rhino_QFP:TMC_RHINO; OC_DIGIKEY: _

## Net classes
0 default: width 0.3 mm, drill 0.3 mm, clearance 0.3 mm
1 wider: width 0.4 mm, drill 0.3 mm, clearance 0.4 mm